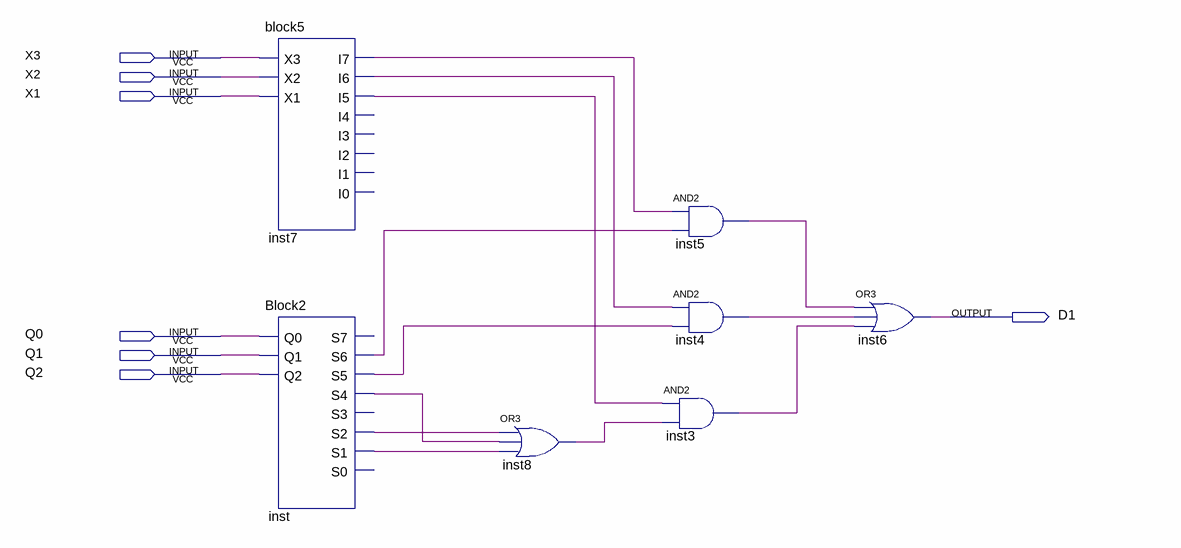
[diagram p0: schematic sheet]
// Quartus schematic block7.bdf as structural Verilog: 7 symbols, 7 pins
module block7 (
  input  X3,
  input  X2,
  input  X1,
  input  Q0,
  input  Q1,
  input  Q2,
  output D1
);

  wire inst3_out, inst4_out, inst5_out, inst7_i5, inst7_i6, inst7_i7, inst8_out, inst_s1, inst_s2, inst_s4,
       inst_s5, inst_s6;

  block5 inst7 (.X3(X3), .X2(X2), .X1(X1), .I7(inst7_i7), .I6(inst7_i6), .I5(inst7_i5));  // open: I4, I3, I2, I1, I0
  Block2 inst (
    .Q0(Q0), .Q1(Q1), .Q2(Q2), .S6(inst_s6), .S5(inst_s5), .S4(inst_s4), .S2(inst_s2), .S1(inst_s1));  // open: S7, S3, S0
  or inst8 (inst8_out, inst_s2, inst_s4, inst_s1);
  and inst5 (inst5_out, inst7_i7, inst_s6);
  and inst4 (inst4_out, inst7_i6, inst_s5);
  and inst3 (inst3_out, inst7_i5, inst8_out);
  or inst6 (D1, inst5_out, inst4_out, inst3_out);
endmodule
